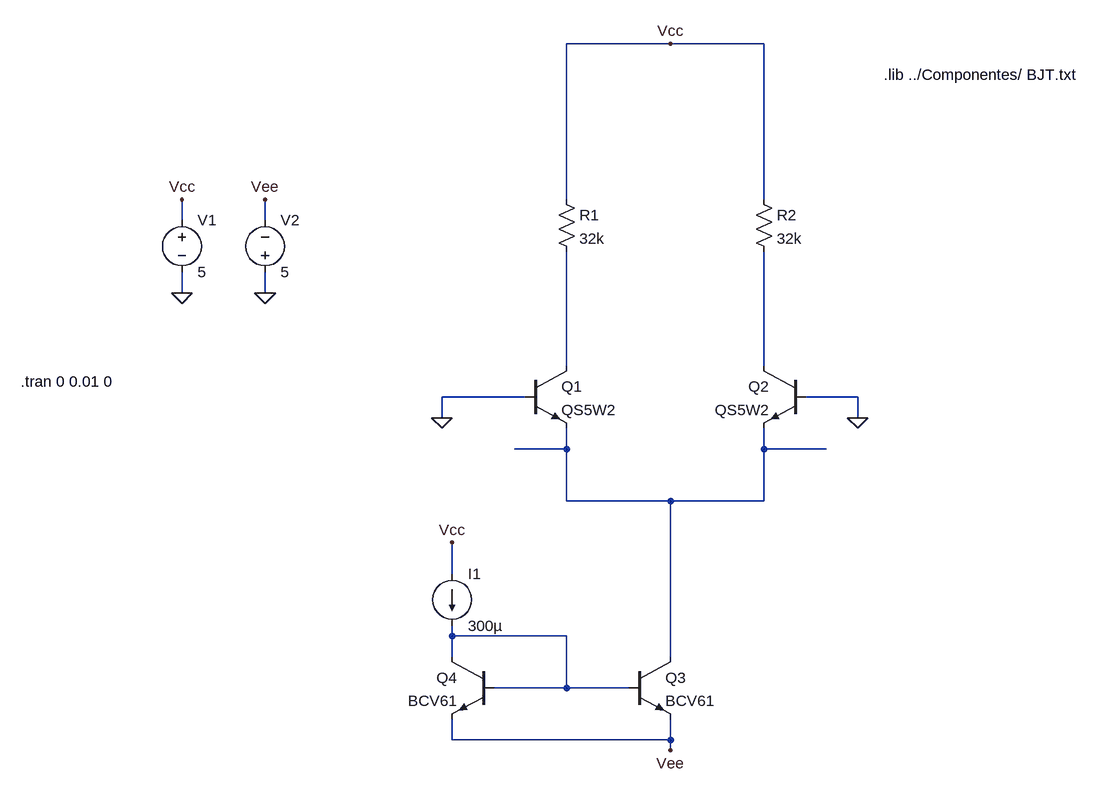
[diagram p0: schematic simulacion DC.asc]
simulacion DC.asc, the LTspice schematic file:
Version 4
SHEET 1 1252 828
WIRE 112 -352 -48 -352
WIRE 256 -352 112 -352
WIRE -48 -112 -48 -352
WIRE 256 -112 256 -352
WIRE -640 -80 -640 -112
WIRE -512 -80 -512 -112
WIRE -640 32 -640 0
WIRE -512 32 -512 0
WIRE 256 48 256 -32
WIRE -48 144 -48 -32
WIRE 256 144 256 48
WIRE -112 192 -240 192
WIRE 400 192 320 192
WIRE -240 224 -240 192
WIRE 400 224 400 192
WIRE -48 272 -48 240
WIRE -48 272 -128 272
WIRE 256 272 256 240
WIRE 352 272 256 272
WIRE -48 352 -48 272
WIRE 112 352 -48 352
WIRE 256 352 256 272
WIRE 256 352 112 352
WIRE -224 464 -224 416
WIRE 112 512 112 352
WIRE -224 560 -224 544
WIRE -48 560 -224 560
WIRE -224 592 -224 560
WIRE 112 592 112 512
WIRE -48 640 -48 560
WIRE -48 640 -160 640
WIRE 48 640 -48 640
WIRE -224 720 -224 688
WIRE 112 720 112 688
WIRE 112 720 -224 720
WIRE 112 736 112 720
FLAG -640 32 0
FLAG -512 32 0
FLAG -640 -112 Vcc
FLAG -512 -112 Vee
FLAG 112 -352 Vcc
FLAG 112 736 Vee
FLAG -224 416 Vcc
FLAG -240 224 0
FLAG 400 224 0
DATAFLAG -128 272 ""
DATAFLAG 352 272 ""
DATAFLAG 16 384 "Ie(Q1)"
DATAFLAG 208 384 "Ie(Q2)"
DATAFLAG 112 512 "Ic(Q3)"
DATAFLAG 256 48 ""
SYMBOL npn -112 144 R0
SYMATTR InstName Q1
SYMATTR Value QS5W2
SYMBOL npn 320 144 M0
SYMATTR InstName Q2
SYMATTR Value QS5W2
SYMBOL voltage -640 -96 R0
WINDOW 123 0 0 Left 2
WINDOW 39 0 0 Left 2
SYMATTR InstName V1
SYMATTR Value 5
SYMBOL voltage -512 16 M180
WINDOW 0 24 96 Left 2
WINDOW 3 24 16 Left 2
WINDOW 123 0 0 Left 2
WINDOW 39 0 0 Left 2
SYMATTR InstName V2
SYMATTR Value 5
SYMBOL npn 48 592 R0
SYMATTR InstName Q3
SYMATTR Value BCV61
SYMBOL npn -160 592 M0
SYMATTR InstName Q4
SYMATTR Value BCV61
SYMBOL current -224 464 R0
WINDOW 123 0 0 Left 2
WINDOW 39 0 0 Left 2
SYMATTR InstName I1
SYMATTR Value 300µ
SYMBOL res -64 -128 R0
SYMATTR InstName R1
SYMATTR Value 32k
SYMBOL res 240 -128 R0
SYMATTR InstName R2
SYMATTR Value 32k
TEXT 440 -304 Left 2 !.lib ../Componentes/ BJT.txt
TEXT -888 168 Left 2 !.tran 0 0.01 0

The netlist it stands for:
* simulacion DC.asc
Q1 N002 0 N003 0 QS5W2
Q2 N001 0 N003 0 QS5W2
V1 Vcc 0 5
V2 0 Vee 5
Q3 N003 N004 Vee 0 BCV61
Q4 N004 N004 Vee 0 BCV61
I1 Vcc N004 300µ
R1 Vcc N002 32k
R2 Vcc N001 32k
.model NPN NPN
.model PNP PNP
.lib standard.bjt
.lib ../Componentes/ BJT.txt
.tran 0 0.01 0
.backanno
.end